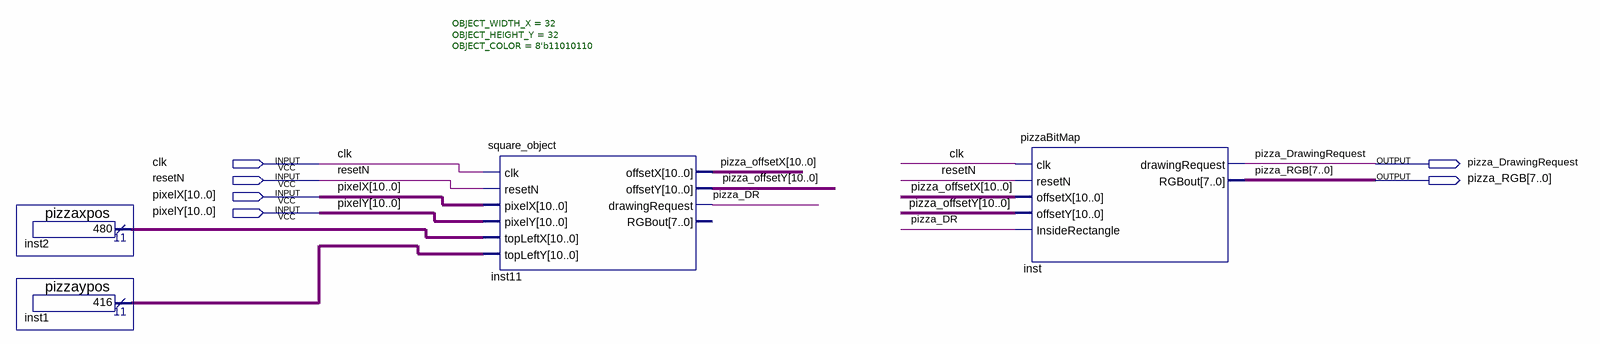
[diagram p0: schematic sheet]
// Quartus schematic PIZZA_DISPLAY.bdf as structural Verilog: 4 symbols, 6 pins
module PIZZA_DISPLAY (
  input  clk,
  input  resetN,
  input  [10:0] pixelX,
  input  [10:0] pixelY,
  output pizza_DrawingRequest,
  output [7:0] pizza_RGB
);

  wire pizza_DR;
  wire [10:0] inst1_result, inst2_result, pizza_offsetX, pizza_offsetY;

  pizzaxpos inst2 (.result(inst2_result));
  pizzaypos inst1 (.result(inst1_result));
  square_object #(.OBJECT_WIDTH_X(32), .OBJECT_HEIGHT_Y(32), .OBJECT_COLOR(8'b11010110)) inst11 (
    .clk(clk), .resetN(resetN), .pixelX(pixelX), .pixelY(pixelY), .topLeftX(inst2_result),
    .topLeftY(inst1_result), .offsetX(pizza_offsetX), .offsetY(pizza_offsetY), .drawingRequest(pizza_DR));  // open: RGBout
  pizzaBitMap inst (
    .clk(clk), .resetN(resetN), .offsetX(pizza_offsetX), .offsetY(pizza_offsetY), .InsideRectangle(pizza_DR),
    .drawingRequest(pizza_DrawingRequest), .RGBout(pizza_RGB));
endmodule
